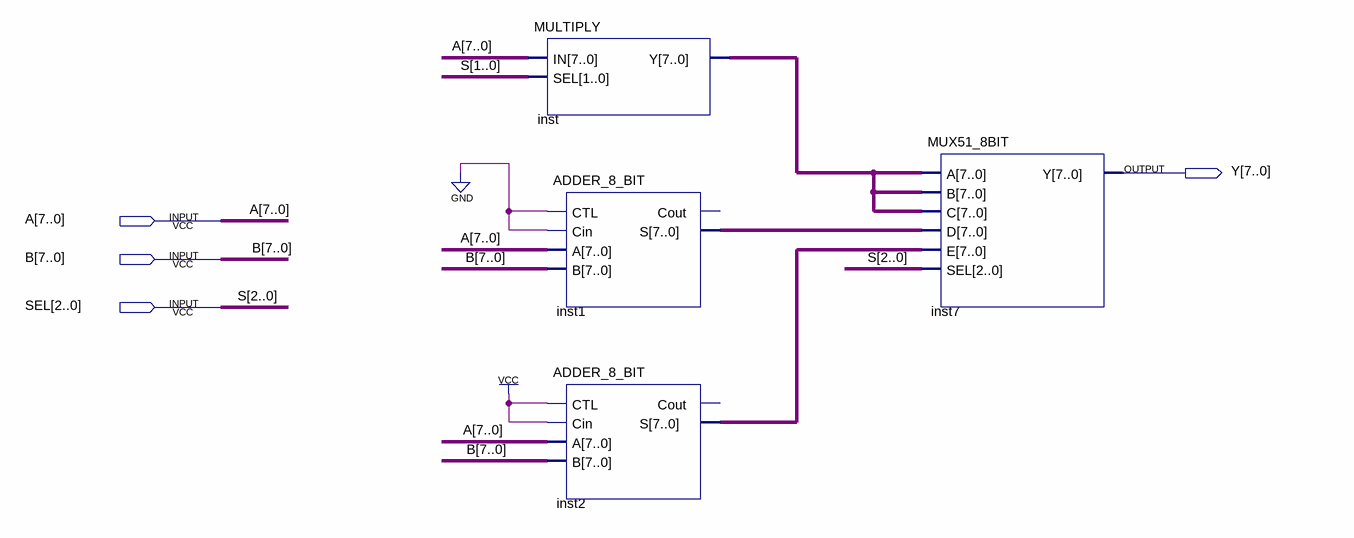
[diagram p0: schematic sheet]
// Quartus schematic ALU.bdf as structural Verilog: 4 symbols, 4 pins
module ALU (
  input  [7:0] A,
  input  [7:0] B,
  input  [2:0] SEL,
  output [7:0] Y
);

  wire [7:0] inst1_s, inst2_s, inst_y;

  MULTIPLY inst (.IN(A), .SEL(SEL[1:0]), .Y(inst_y));
  ADDER_8_BIT inst1 (.CTL(1'b0), .Cin(1'b0), .A(A), .B(B), .S(inst1_s));  // open: Cout
  ADDER_8_BIT inst2 (.CTL(1'b1), .Cin(1'b1), .A(A), .B(B), .S(inst2_s));  // open: Cout
  MUX51_8BIT inst7 (.A(inst_y), .B(inst_y), .C(inst_y), .D(inst1_s), .E(inst2_s), .SEL(SEL), .Y(Y));

  // Other names for the same wires on the sheet: S[2:0] = SEL
endmodule
